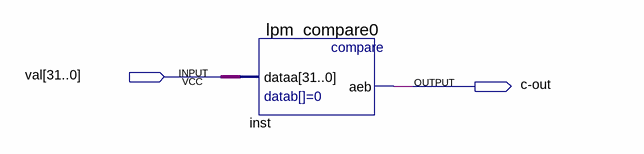
[diagram p0: schematic sheet]
// Quartus schematic zero-comp.bdf as structural Verilog: 1 symbols, 2 pins
module \zero-comp  (
  input  [31:0] val,
  output \c-out 
);

  lpm_compare0 inst (.dataa(val), .aeb(\c-out ));
endmodule
